# EAGLE schematic bateria (EAGLE 9.6.2)
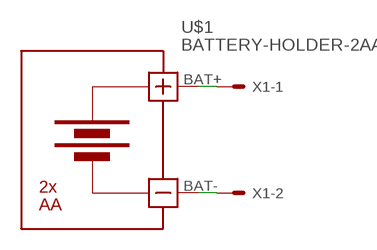
[diagram p0: schematic, sheet 1]

## Parts
U$1  BATTERY-HOLDER-2AA  [BATTERY-HOLDER-2AA]
X1  KK-156-2  [KK-156-2]

## Nets
N$1: U$1.BAT+ X1.1
N$2: U$1.BAT- X1.2

## Library data of the parts
U$1 = diy-modules:BATTERY-HOLDER-2AA: Battery Holder 2 x AA Click here to find device on ebay.com <http://www.ebay.com/sch/battery+plastic+holder+aa+2x1.5v>
X1 = con-molex:KK-156-2: KK 156 HEADER Source: http://www.molex.com/pdm_docs/sd/026604100_sd.pdf; MF: MOLEX; OC_FARNELL: unknown; OC_NEWARK: unknown